# EAGLE design MainBoard (EAGLE 9.6.2)
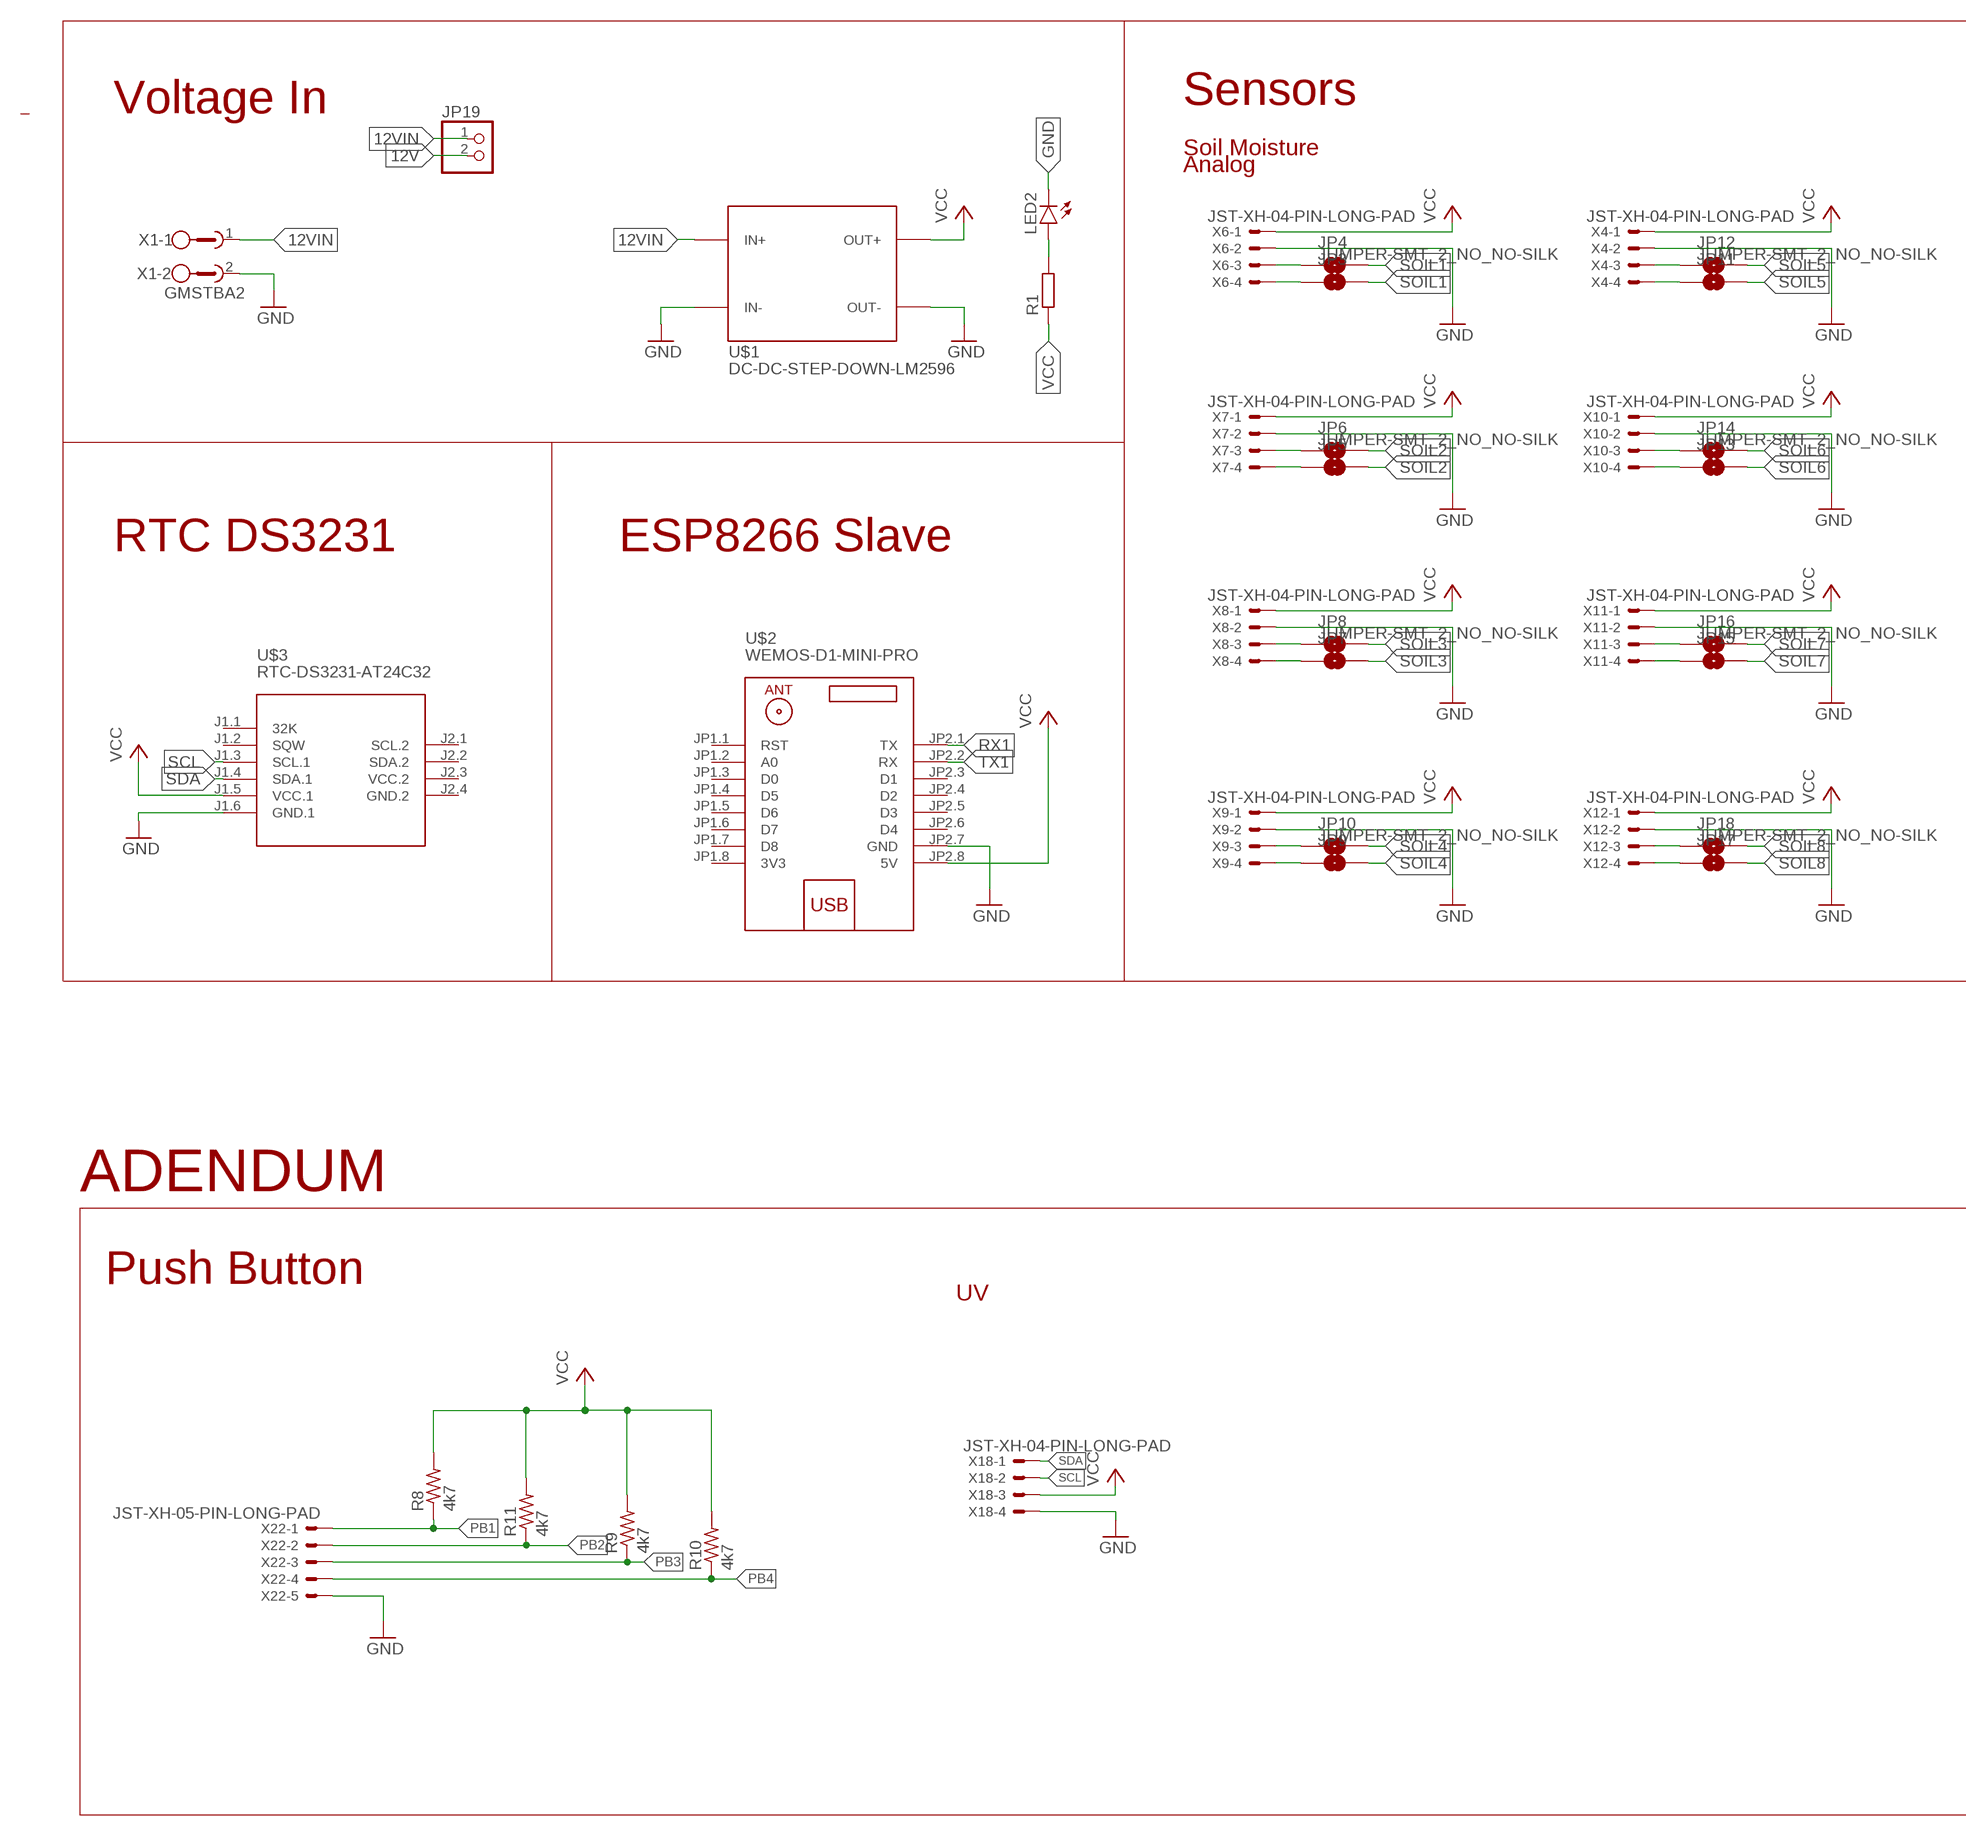
[diagram p0: schematic, sheet 1, part 1 of 2]
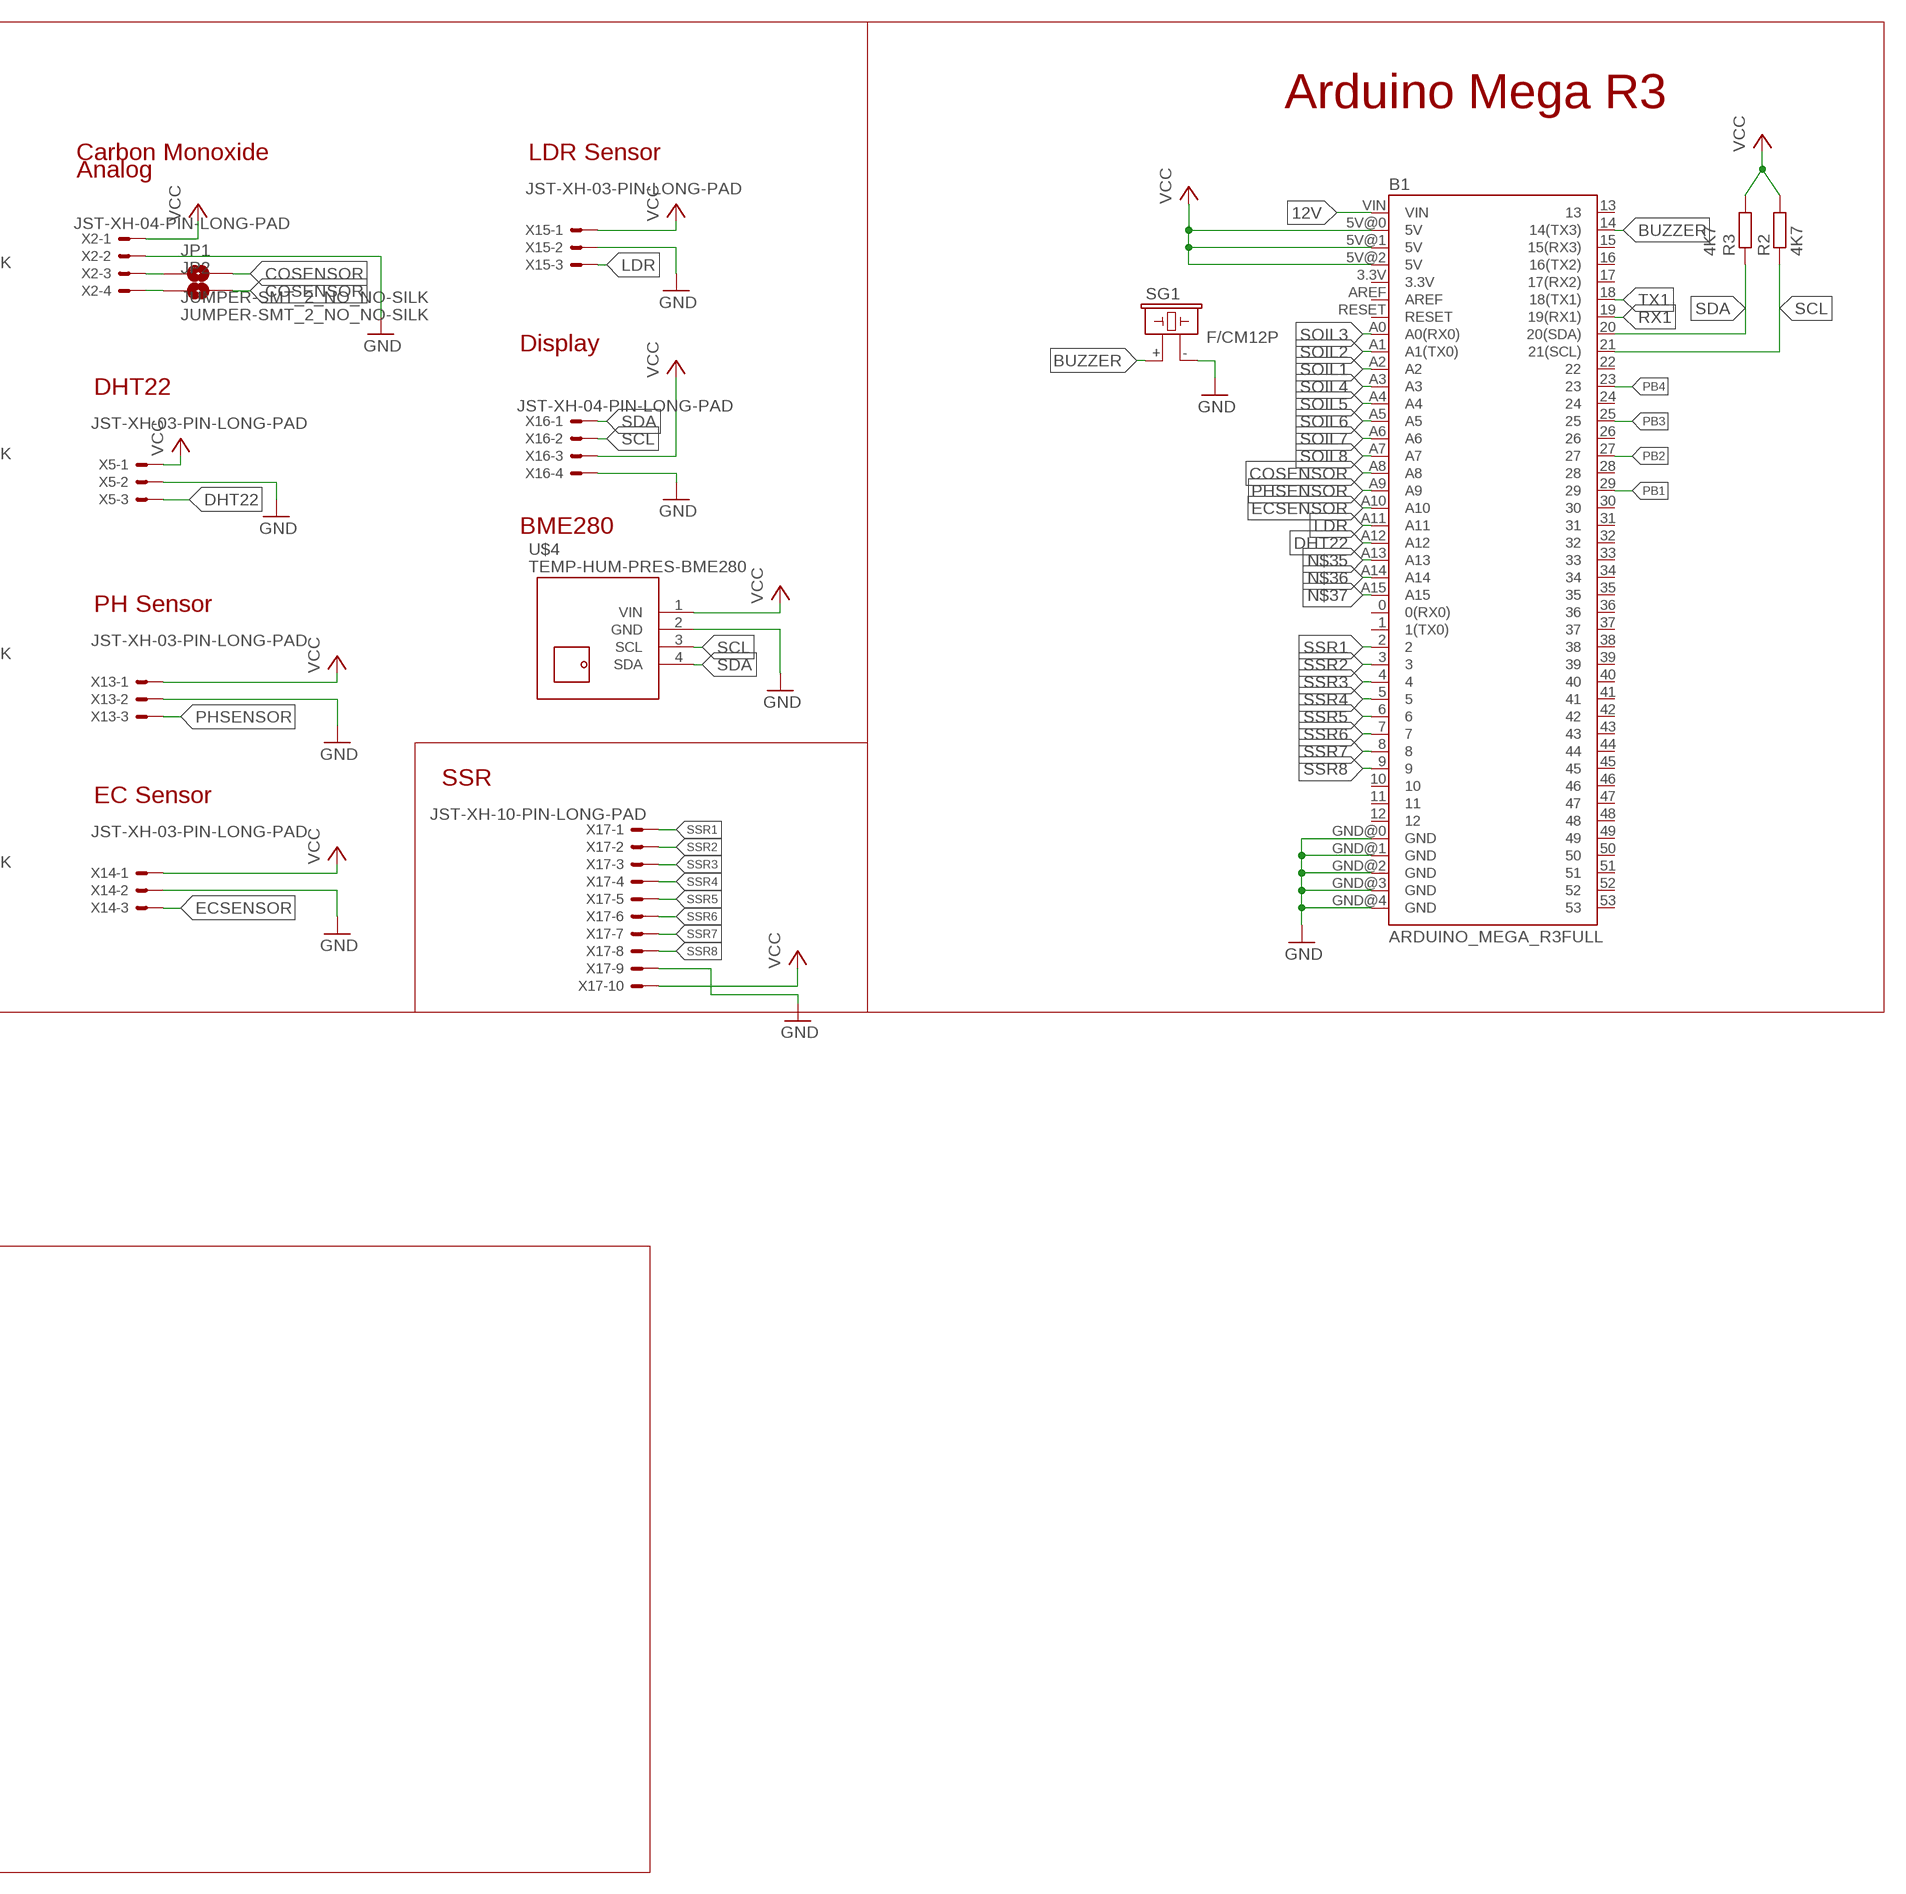
[diagram p1: schematic, sheet 1, part 2 of 2]

## Parts
B1  ARDUINO_MEGA_R3FULL  [ARDUINO_MEGA]
JP1  JUMPER-SMT_2_NO_NO-SILK  [SMT-JUMPER_2_NO_NO-SILK]
JP2  JUMPER-SMT_2_NO_NO-SILK  [SMT-JUMPER_2_NO_NO-SILK]
JP3  JUMPER-SMT_2_NO_NO-SILK  [SMT-JUMPER_2_NO_NO-SILK]
JP4  JUMPER-SMT_2_NO_NO-SILK  [SMT-JUMPER_2_NO_NO-SILK]
JP5  JUMPER-SMT_2_NO_NO-SILK  [SMT-JUMPER_2_NO_NO-SILK]
JP6  JUMPER-SMT_2_NO_NO-SILK  [SMT-JUMPER_2_NO_NO-SILK]
JP7  JUMPER-SMT_2_NO_NO-SILK  [SMT-JUMPER_2_NO_NO-SILK]
JP8  JUMPER-SMT_2_NO_NO-SILK  [SMT-JUMPER_2_NO_NO-SILK]
JP9  JUMPER-SMT_2_NO_NO-SILK  [SMT-JUMPER_2_NO_NO-SILK]
JP10  JUMPER-SMT_2_NO_NO-SILK  [SMT-JUMPER_2_NO_NO-SILK]
JP11  JUMPER-SMT_2_NO_NO-SILK  [SMT-JUMPER_2_NO_NO-SILK]
JP12  JUMPER-SMT_2_NO_NO-SILK  [SMT-JUMPER_2_NO_NO-SILK]
JP13  JUMPER-SMT_2_NO_NO-SILK  [SMT-JUMPER_2_NO_NO-SILK]
JP14  JUMPER-SMT_2_NO_NO-SILK  [SMT-JUMPER_2_NO_NO-SILK]
JP15  JUMPER-SMT_2_NO_NO-SILK  [SMT-JUMPER_2_NO_NO-SILK]
JP16  JUMPER-SMT_2_NO_NO-SILK  [SMT-JUMPER_2_NO_NO-SILK]
JP17  JUMPER-SMT_2_NO_NO-SILK  [SMT-JUMPER_2_NO_NO-SILK]
JP18  JUMPER-SMT_2_NO_NO-SILK  [SMT-JUMPER_2_NO_NO-SILK]
JP19  PINHD-1X2  [1X02]
LED2  LED5MM  [LED5MM]
R1  R-EU_R0805  [R0805]
R2  4K7  R-EU_M0805  [M0805]
R3  4K7  R-EU_M0805  [M0805]
R8  4k7  R-US_M0805  [M0805]
R9  4k7  R-US_M0805  [M0805]
R10  4k7  R-US_M0805  [M0805]
R11  4k7  R-US_M0805  [M0805]
SG1  F/CM12P  [F/CM12P]
U$1  DC-DC-STEP-DOWN-LM2596  [DC-DC-STEP-DOWN-LM2596]
U$2  WEMOS-D1-MINI-PRO  [WEMOS-D1-MINI-PRO]
U$3  RTC-DS3231-AT24C32  [RTC-DS3231-AT24C32]
U$4  TEMP-HUM-PRES-BME280  [TEMP-HUM-PRES-BME280]
X1  GMSTBA2  [GMSTBA2]
X2  JST-XH-04-PIN-LONG-PAD  [JST-XH-04-PACKAGE-LONG-PAD]
X4  JST-XH-04-PIN-LONG-PAD  [JST-XH-04-PACKAGE-LONG-PAD]
X5  JST-XH-03-PIN-LONG-PAD  [JST-XH-03-PACKAGE-LONG-PAD]
X6  JST-XH-04-PIN-LONG-PAD  [JST-XH-04-PACKAGE-LONG-PAD]
X7  JST-XH-04-PIN-LONG-PAD  [JST-XH-04-PACKAGE-LONG-PAD]
X8  JST-XH-04-PIN-LONG-PAD  [JST-XH-04-PACKAGE-LONG-PAD]
X9  JST-XH-04-PIN-LONG-PAD  [JST-XH-04-PACKAGE-LONG-PAD]
X10  JST-XH-04-PIN-LONG-PAD  [JST-XH-04-PACKAGE-LONG-PAD]
X11  JST-XH-04-PIN-LONG-PAD  [JST-XH-04-PACKAGE-LONG-PAD]
X12  JST-XH-04-PIN-LONG-PAD  [JST-XH-04-PACKAGE-LONG-PAD]
X13  JST-XH-03-PIN-LONG-PAD  [JST-XH-03-PACKAGE-LONG-PAD]
X14  JST-XH-03-PIN-LONG-PAD  [JST-XH-03-PACKAGE-LONG-PAD]
X15  JST-XH-03-PIN-LONG-PAD  [JST-XH-03-PACKAGE-LONG-PAD]
X16  JST-XH-04-PIN-LONG-PAD  [JST-XH-04-PACKAGE-LONG-PAD]
X17  JST-XH-10-PIN-LONG-PAD  [JST-XH-10-PACKAGE-LONG-PAD]
X18  JST-XH-04-PIN-LONG-PAD  [JST-XH-04-PACKAGE-LONG-PAD]
X22  JST-XH-05-PIN-LONG-PAD  [JST-XH-05-PACKAGE-LONG-PAD]

## Nets
12V: B1.VIN JP19.2
12VIN: JP19.1 U$1.IN+ X1.1
BUZZER: B1.14(14(TX3)) SG1.+
COSENSOR: B1.A8 JP1.2 JP2.2
DHT22: B1.A12 X5.3
ECSENSOR: B1.A10 X14.3
GND: B1.GND@0(GND) B1.GND@1(GND) B1.GND@2(GND) B1.GND@3(GND) B1.GND@4(GND) LED2.K(C) SG1.- U$1.IN- U$1.OUT- U$2.JP2.7(GND) U$3.J1.6(GND.1) U$4.2(GND) X1.2 X2.2 X4.2 X5.2 X6.2 X7.2 X8.2 X9.2 X10.2 X11.2 X12.2 X13.2 X14.2 X15.2 X16.4 X17.9 X18.4 X22.5
LDR: B1.A11 X15.3
N$1: JP1.1 X2.3
N$2: JP2.1 X2.4
N$5: JP3.1 X6.4
N$6: JP4.1 X6.3
N$7: LED2.A R1.2
N$8: JP5.1 X7.4
N$9: JP6.1 X7.3
N$10: JP7.1 X8.4
N$11: JP8.1 X8.3
N$12: JP9.1 X9.4
N$13: JP10.1 X9.3
N$14: JP11.1 X4.4
N$15: JP12.1 X4.3
N$16: JP13.1 X10.4
N$17: JP14.1 X10.3
N$18: JP15.1 X11.4
N$19: JP16.1 X11.3
N$20: JP17.1 X12.4
N$21: JP18.1 X12.3
N$35: B1.A13
N$36: B1.A14
N$37: B1.A15
PB1: B1.29 R8.1 X22.1
PB2: B1.27 R11.1 X22.2
PB3: B1.25 R9.1 X22.3
PB4: B1.23 R10.1 X22.4
PHSENSOR: B1.A9 X13.3
RX1: B1.19(19(RX1)) U$2.JP2.1(TX)
SCL: B1.21(21(SCL)) R2.1 U$3.J1.3(SCL.1) U$4.3(SCL) X16.2 X18.2
SDA: B1.20(20(SDA)) R3.1 U$3.J1.4(SDA.1) U$4.4(SDA) X16.1 X18.1
SOIL1: B1.A2 JP3.2 JP4.2
SOIL2: B1.A1(A1(TX0)) JP5.2 JP6.2
SOIL3: B1.A0(A0(RX0)) JP7.2 JP8.2
SOIL4: B1.A3 JP9.2 JP10.2
SOIL5: B1.A4 JP11.2 JP12.2
SOIL6: B1.A5 JP13.2 JP14.2
SOIL7: B1.A6 JP15.2 JP16.2
SOIL8: B1.A7 JP17.2 JP18.2
SSR1: B1.2 X17.1
SSR2: B1.3 X17.2
SSR3: B1.4 X17.3
SSR4: B1.5 X17.4
SSR5: B1.6 X17.5
SSR6: B1.7 X17.6
SSR7: B1.8 X17.7
SSR8: B1.9 X17.8
TX1: B1.18(18(TX1)) U$2.JP2.2(RX)
VCC: B1.5V@0(5V) B1.5V@1(5V) B1.5V@2(5V) R1.1 R2.2 R3.2 R8.2 R9.2 R10.2 R11.2 U$1.OUT+ U$2.JP2.8(5V) U$3.J1.5(VCC.1) U$4.1(VIN) X2.1 X4.1 X5.1 X6.1 X7.1 X8.1 X9.1 X10.1 X11.1 X12.1 X13.1 X14.1 X15.1 X16.3 X17.10 X18.3
Unconnected: B1.0(0(RX0)) B1.1(1(TX0)) B1.3.3V B1.10 B1.11 B1.12 B1.13 B1.15(15(RX3)) B1.16(16(TX2)) B1.17(17(RX2)) B1.22 B1.24 B1.26 B1.28 B1.30 B1.31 B1.32 B1.33 B1.34 B1.35 B1.36 B1.37 B1.38 B1.39 B1.40 B1.41 B1.42 B1.43 B1.44 B1.45 B1.46 B1.47 B1.48 B1.49 B1.50 B1.51 B1.52 B1.53 B1.AREF B1.RESET U$2.JP1.1(RST) U$2.JP1.2(A0) U$2.JP1.3(D0) U$2.JP1.4(D5) U$2.JP1.5(D6) U$2.JP1.6(D7) U$2.JP1.7(D8) U$2.JP2.3(D1) U$2.JP2.4(D2) U$2.JP2.5(D3) U$2.JP2.6(D4) U$3.J1.1(32K) U$3.J1.2(SQW) U$3.J2.1(SCL.2) U$3.J2.2(SDA.2)

## Notes on the sheet
- Voltage In | Sensors | Arduino Mega R3
- Soil Moisture | Carbon Monoxide | LDR Sensor
- Analog | Analog
- Display
- DHT22
- BME280
- RTC DS3231 | ESP8266 Slave
- PH Sensor
- SSR
- EC Sensor
- ADENDUM
- Push Button
- UV

## Power pins joined to a net without a drawn wire
3V3: U$2.JP1.8(3V3)
GND.2: U$3.J2.4(GND.2)
VCC.2: U$3.J2.3(VCC.2)

## Library data of the parts
B1 = SparkFun-Boards:ARDUINO_MEGA_R3: Arduino Mega R3 ATmega2560 R3 compatible footprint. SparkFun Products: Arduino Mega 2560 R3 <https://www.sparkfun.com/products/11061>
JP1-JP18 = SparkFun-Jumpers:JUMPER-SMT_2_NO: Normally open jumper This jumper has two pads in close proximity to each other. Apply solder to close the connection. Round pads are easier to solder for beginners, but are a lot larger. SparkFun Product that uses the round pads: SparkFun EL Sequencer <https://www.sparkfun.com/products/12781>
JP19 = pinhead:PINHD-1X2: PIN HEADER
LED2 = led:LED: LED OSRAM: - CHIPLED LG R971, LG N971, LY N971, LG Q971, LY Q971, LO R971, LY R971 LH N974, LH R974 LS Q976, LO Q976, LY Q976 LO Q996 - Hyper CHIPLED LW Q18S LB Q993, LB Q99A, LB R99A - SideLED LS A670, LO A670, LY A670, LG A670, LP A670 LB A673, LV A673, LT A673, LW A673 LH A674 LY A675 LS A676, LA A676, LO A676, LY A676, LW A676 LS A679, LY A679, LG A679 - Hyper Micro SIDELED® LS Y876, LA Y876, LO Y876, LY Y876 LT Y87S - SmartLED LW L88C, LW L88S LB L89C, LB L89S, LG L890 LS L89K, LO L89K, LY L89K LS L896, LA L896, LO L896, LY L896 - TOPLED LS T670, LO T670, LY T670, LG T670, LP T670 LSG T670, LSP T670, LSY T670, LOP T670, LYG T670 LG T671, LOG T671, LSG T671 LB T673, LV T673, LT T673, LW T673 LH T674 LS T676, LA T676, LO T676, LY T676, LB T676, LH T676, LSB T676, LW T676 LB T67C, LV T67C, LT T67C, LS T67K, LO T67K, LY T67K, LW E67C LS E67B, LA E67B, LO E67B, LY E67B, LB E67C, LV E67C, LT E67C LW T67C LS T679, LY T679, LG T679 LS T770, LO T770, LY T770, LG T770, LP T770 LB T773, LV T773, LT T773, LW T773 LH T774 LS E675, LA E675, LY E675, LS T675 LS T776, LA T776, LO T776, LY T776, LB T776 LHGB T686 LT T68C, LB T68C - Hyper Mini TOPLED® LB M676 - Mini TOPLED Santana® LG M470 LS M47K, LO M47K, LY M47K Source: http://www.osram.convergy.de LUXEON: - LUMILED® LXK2-PW12-R00, LXK2-PW12-S00, LXK2-PW14-U00, LXK2-PW14-V00 LXK2-PM12-R00, LXK2-PM12-S00, LXK2-PM14-U00 LXK2-PE12-Q00, LXK2-PE12-R00, LXK2-PE12-S00, LXK2-PE14-T00, LXK2-PE14-U00 LXK2-PB12-K00, LXK2-PB12-L00, LXK2-PB12-M00, LXK2-PB14-N00, LXK2-PB14-P00, LXK2-PB14-Q00 LXK2-PR12-L00, LXK2-PR12-M00, LXK2-PR14-Q00, LXK2-PR14-R00 LXK2-PD12-Q00, LXK2-PD12-R00, LXK2-PD12-S00 LXK2-PH12-R00, LXK2-PH12-S00 LXK2-PL12-P00, LXK2-PL12-Q00, LXK2-PL12-R00 Source: www.luxeon.com KINGBRIGHT: KA-3528ASYC Source: www.kingbright.com
R1-R3 = rcl:R-EU_: RESISTOR, European symbol; SPICEPREFIX: R
R8-R11 = rcl:R-US_: RESISTOR, American symbol; SPICEPREFIX: R
SG1 = buzzer:F/CM12P: BUZZER Source: Buerklin; OC_FARNELL: unknown; OC_NEWARK: unknown
U$1 = diy-modules:DC-DC-STEP-DOWN-LM2596: DC/DC Step-Down Regulator based on LM2596-ADJ chip LM2596 datasheet available here: http://www.ti.com/lit/ds/symlink/lm2596.pdf Click here to find device on ebay.com <http://www.ebay.com/sch/lm2596+power+regulator>
U$2 = diy-modules:WEMOS-D1-MINI-PRO: WEMOS D1 mini Pro: Mini Wi-Fi Board based on ESP-8266EX chip More details can be found here: https://www.wemos.cc/product/d1-mini-pro.html Click here to find device on ebay.com <http://www.ebay.com/sch/wemos+d1+mini+pro>
U$3 = diy-modules:RTC-DS3231-AT24C32: RTC Module with Battery and EEPROM based on DS3231 and AT24C32 chips Tutorial can be found here: https://edwardmallon.wordpress.com/2014/05/21/using-a-cheap-3-ds3231-rtc-at24c32-eeprom-from-ebay/ Click here to find device on ebay.com <http://www.ebay.com/sch/DS3231+AT24C32+module>
U$4 = diy-modules:TEMP-HUM-PRES-BME280: Digital Humidity-Temperature-Pressure Sensor based on BME280 device More information about BME280 device is available here: https://www.bosch-sensortec.com/bst/products/all_products/bme280 Click here to find device on ebay.com <http://www.ebay.com/sch/bme280+breakout>
X1 = con-phoenix-762:GMSTBA2: PHOENIX; MF: FARNELL; MPN: 1757242; OC_FARNELL: 3705171; OC_NEWARK: 71C4161
X2 X4 X6-X12 X16 X18 = Rembrandt Electronics - JST XH Connectors v1-0:JST-XH-04-PIN: JST XH Connector 2 Pin Wire to board connector. Pitch: 2,54 mm, (0.100") Number of pins: 4 Created by Rembrandt Electronics www.rembrandtelectronics.com
X5 X13-X15 = Rembrandt Electronics - JST XH Connectors v1-0:JST-XH-03-PIN: JST XH Connector 2 Pin Wire to board connector. Pitch: 2,54 mm, (0.100") Number of pins: 3 Created by Rembrandt Electronics www.rembrandtelectronics.com
X17 = Rembrandt Electronics - JST XH Connectors v1-0:JST-XH-10-PIN: JST XH Connector 2 Pin Wire to board connector. Pitch: 2,54 mm, (0.100") Number of pins: 10 Created by Rembrandt Electronics www.rembrandtelectronics.com
X22 = Rembrandt Electronics - JST XH Connectors v1-0:JST-XH-05-PIN: JST XH Connector 2 Pin Wire to board connector. Pitch: 2,54 mm, (0.100") Number of pins: 5 Created by Rembrandt Electronics www.rembrandtelectronics.com

## Board
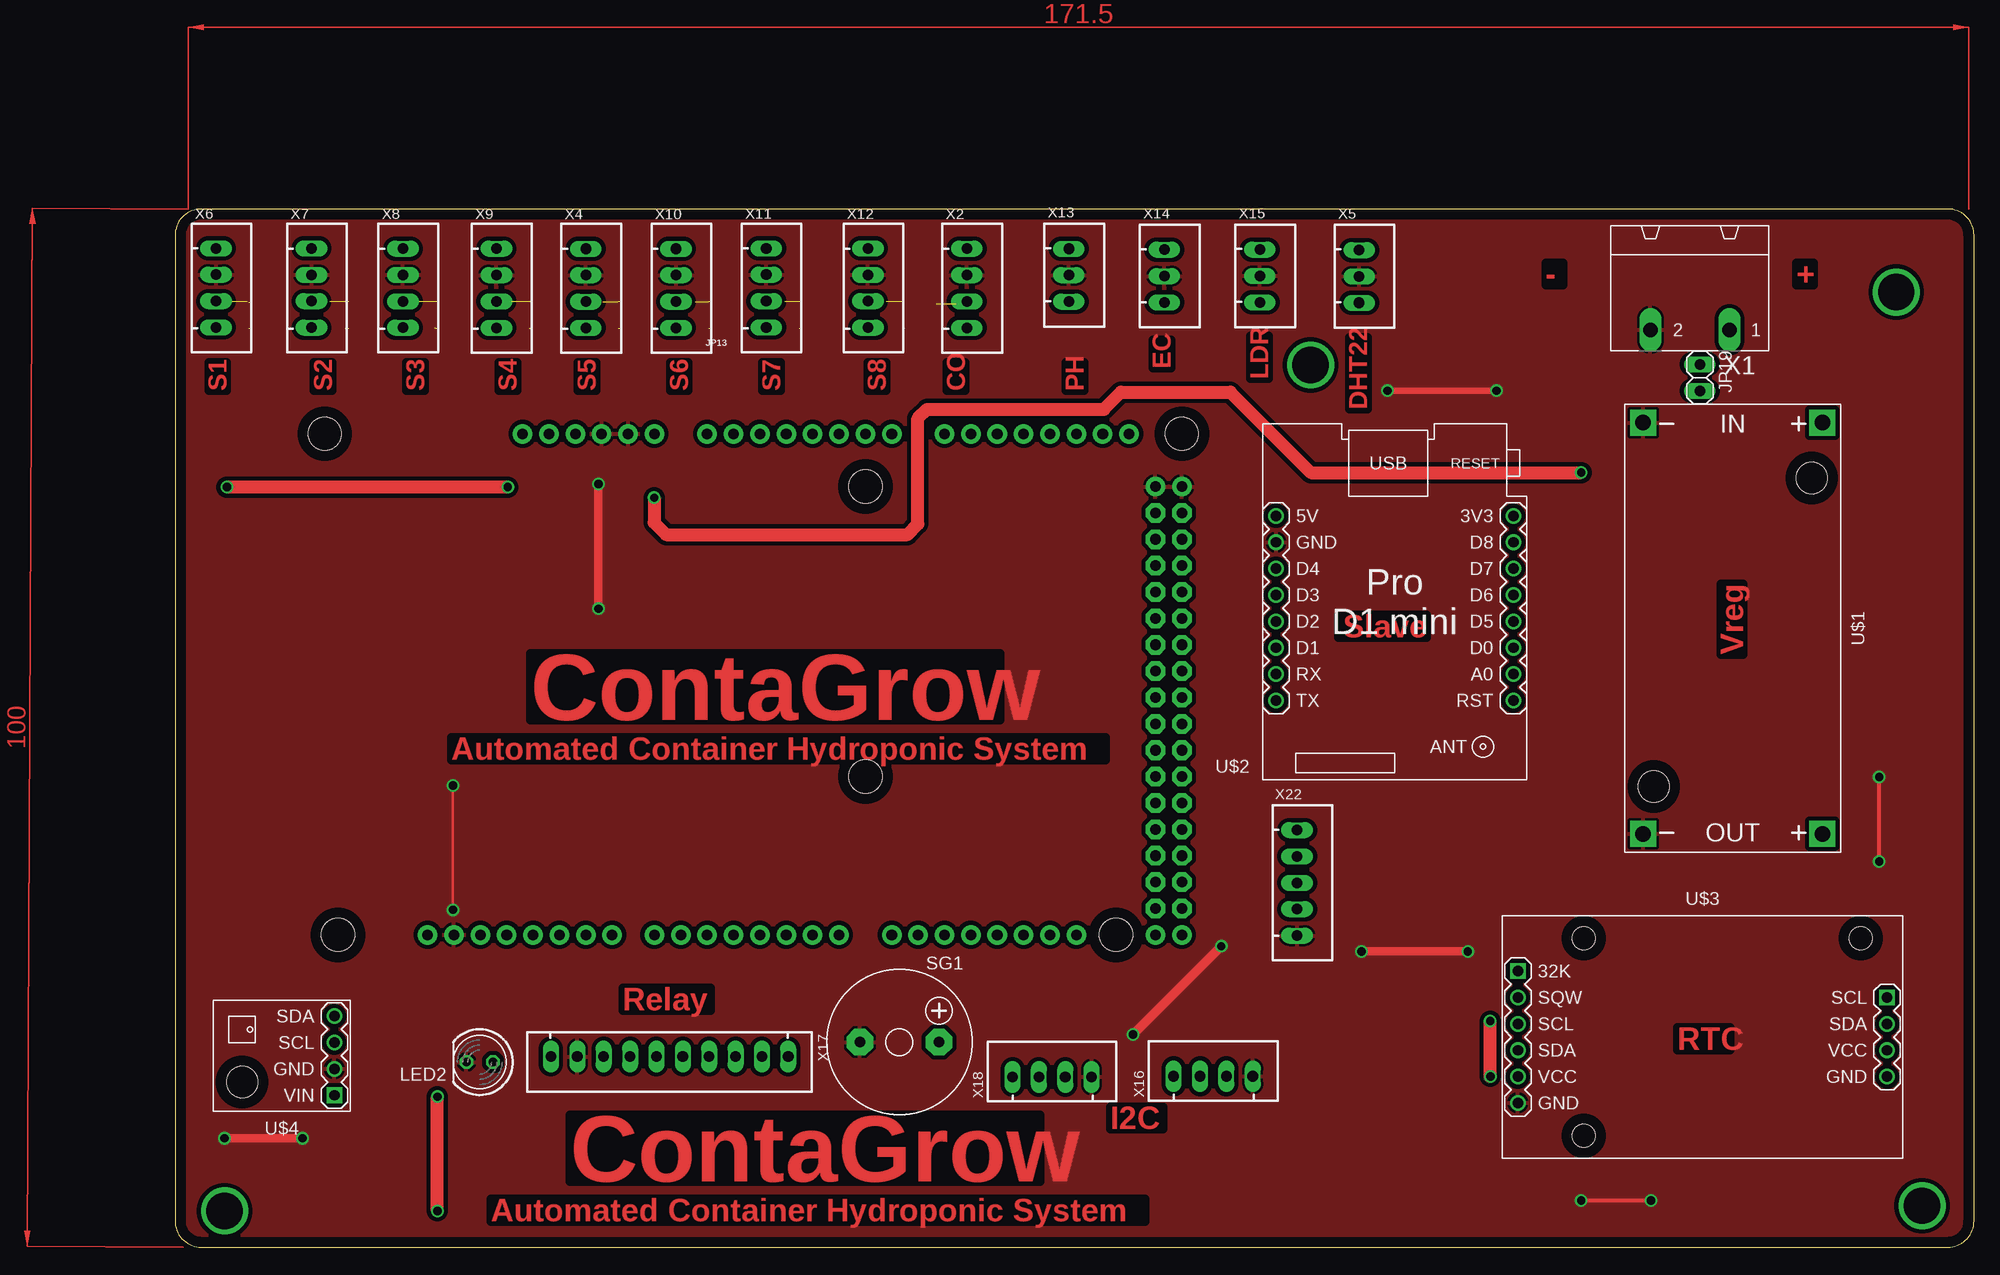
[diagram p2: board, top side]
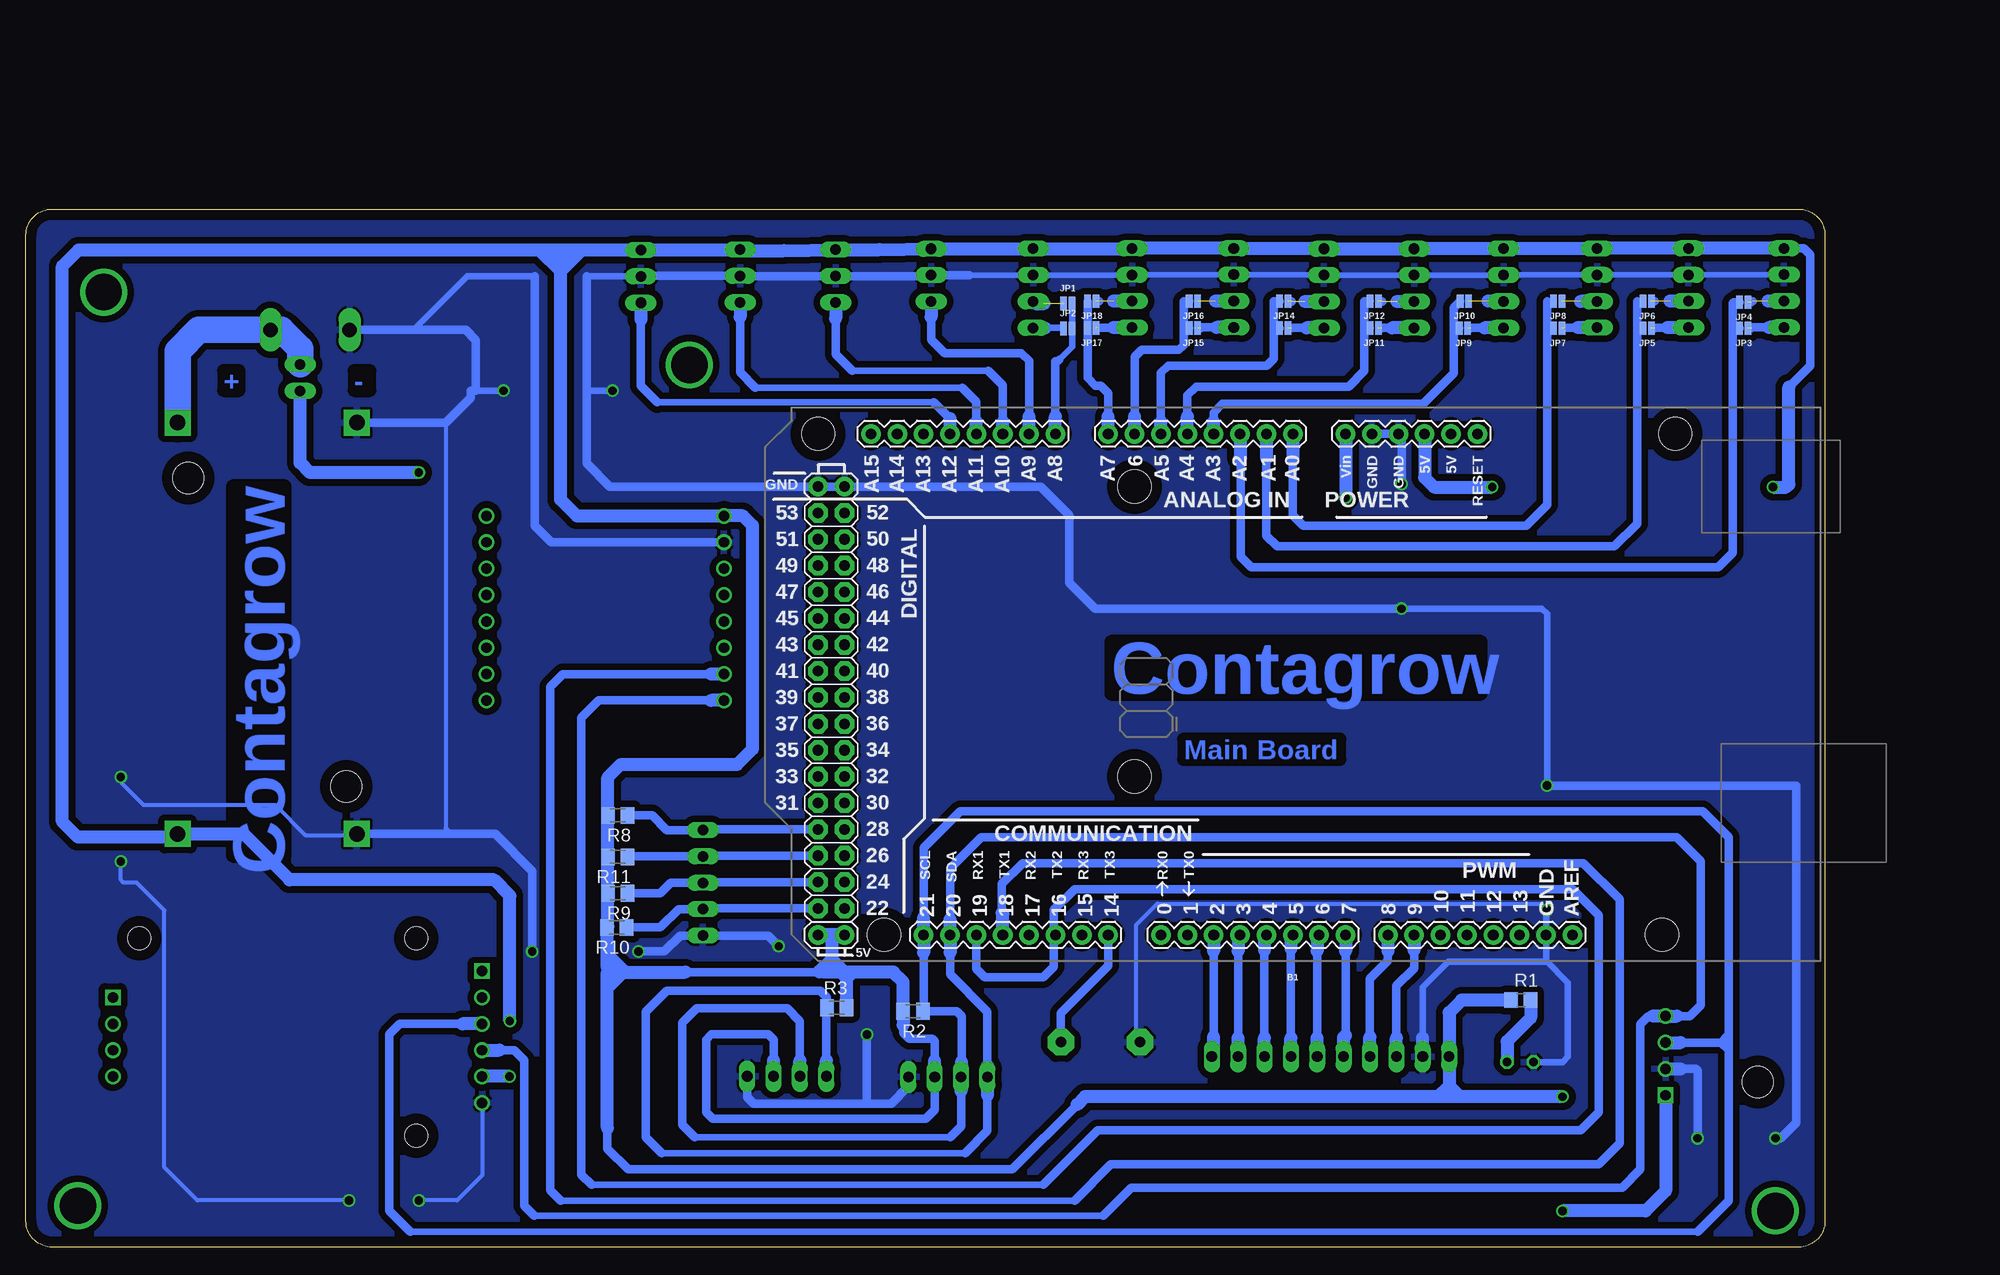
[diagram p3: board, bottom side, seen from below]

Size 173.27 x 100 mm. Coordinates in mm from the lower left corner, seen from the top.
Outline: 2.54,0 170.73,0 arc90 173.27,2.54 173.27,97.46 arc90 170.73,100 2.54,100 arc90 0,97.46 0,2.54 arc90 2.54,0
Copper layers (1*16): Top 0.035mm / dielectric 1.5mm / Bottom 0.035mm
Design rules "default *": minimum track width 6mil, minimum drill 0.35mm, track to track 16mil, track to pad 16mil, pad to pad 16mil, via to via 16mil, smd to smd 16mil, copper to edge 40mil, drill to drill 6mil, minimum pad ring 10mil, minimum via ring 8mil, stop-mask expansion 4mil, vias tented up to drill 0mil, thermal gap 10mil

### Footprints (pad centres in the part's own frame; a part is rotated, then mirrored left to right if it is on the bottom)
ARDUINO_MEGA = drill 1.016 pad 1.88: 0 13.97,24.13; 1 11.43,24.13; 2 8.89,24.13; 3 6.35,24.13; 3.3V -13.97,-24.13; 4 3.81,24.13; 5 1.27,24.13; 5V@0 -11.43,-24.13; 5V@1 44.45,24.13; 5V@2 46.99,24.13; 6 -1.27,24.13; 7 -3.81,24.13; 8 -7.874,24.13; 9 -10.414,24.13; 10 -12.954,24.13; 11 -15.494,24.13; 12 -18.034,24.13; 13 -20.574,24.13; 14 19.05,24.13; 15 21.59,24.13; 16 24.13,24.13; 17 26.67,24.13; 18 29.21,24.13; 19 31.75,24.13; 20 34.29,24.13; 21 36.83,24.13; A0 1.27,-24.13; A1 3.81,-24.13; A2 6.35,-24.13; A3 8.89,-24.13; A4 11.43,-24.13; A5 13.97,-24.13; A6 16.51,-24.13; A7 19.05,-24.13; A8 24.13,-24.13; A9 26.67,-24.13; A10 29.21,-24.13; A11 31.75,-24.13; A12 34.29,-24.13; A13 36.83,-24.13; A14 39.37,-24.13; A15 41.91,-24.13; AREF -25.654,24.13; GND@0 -8.89,-24.13; GND@1 -6.35,-24.13; GND@2 44.45,-19.05; GND@3 46.99,-19.05; GND@4 -23.114,24.13; RESET -16.51,-24.13; VIN -3.81,-24.13 | drill 1.016 pad 1.88 octagon: 22 44.45,21.59; 23 46.99,21.59; 24 44.45,19.05; 25 46.99,19.05; 26 44.45,16.51; 27 46.99,16.51; 28 44.45,13.97; 29 46.99,13.97; 30 44.45,11.43; 31 46.99,11.43; 32 44.45,8.89; 33 46.99,8.89; 34 44.45,6.35; 35 46.99,6.35; 36 44.45,3.81; 37 46.99,3.81; 38 44.45,1.27; 39 46.99,1.27; 40 44.45,-1.27; 41 46.99,-1.27; 42 44.45,-3.81; 43 46.99,-3.81; 44 44.45,-6.35; 45 46.99,-6.35; 46 44.45,-8.89; 47 46.99,-8.89; 48 44.45,-11.43; 49 46.99,-11.43; 50 44.45,-13.97; 51 46.99,-13.97; 52 44.45,-16.51; 53 46.99,-16.51 | hole 3.2: -34.29,24.13; -35.56,-24.13; 16.51,8.89; 16.51,-19.05; 40.64,24.13; 46.99,-24.13
SMT-JUMPER_2_NO_NO-SILK = smd 0.635 x 1.27: 1 -0.406,0; 2 0.406,0
1X02 = drill 1.016 long: 1 -1.27,0; 2 1.27,0
LED5MM = drill 0.813 octagon: A -1.27,0; K 1.27,0
R0805 = smd 1.3 x 1.5: 1 -0.95,0; 2 0.95,0
M0805 = smd 1.3 x 1.6: 1 -0.95,0; 2 0.95,0
F/CM12P = drill 1.016 pad 2.54 octagon: + 3.81,0; - -3.81,0
DC-DC-STEP-DOWN-LM2596 = drill 1.5 pad 2.5 square: IN+ -19.812,8.636; IN- -19.812,-8.636; OUT+ 19.812,8.636; OUT- 19.812,-8.636 | hole 3: -14.478,7.62; 15.24,-7.62
WEMOS-D1-MINI-PRO = drill 1: JP1.1 -11.43,9.525; JP1.2 -11.43,6.985; JP1.3 -11.43,4.445; JP1.4 -11.43,1.905; JP1.5 -11.43,-0.635; JP1.6 -11.43,-3.175; JP1.7 -11.43,-5.715; JP1.8 -11.43,-8.255; JP2.1 11.43,9.525; JP2.2 11.43,6.985; JP2.3 11.43,4.445; JP2.4 11.43,1.905; JP2.5 11.43,-0.635; JP2.6 11.43,-3.175; JP2.7 11.43,-5.715; JP2.8 11.43,-8.255
RTC-DS3231-AT24C32 = drill 1 square: J1.1 -17.78,6.35; J2.1 17.78,3.81 | drill 1: J1.2 -17.78,3.81; J1.3 -17.78,1.27; J1.4 -17.78,-1.27; J1.5 -17.78,-3.81; J1.6 -17.78,-6.35; J2.2 17.78,1.27; J2.3 17.78,-1.27; J2.4 17.78,-3.81 | hole 2.2: -11.43,-9.525; -11.43,9.525; 15.24,9.525
TEMP-HUM-PRES-BME280 = drill 1 square: 1 -5.08,3.81 | drill 1: 2 -5.08,1.27; 3 -5.08,-1.27; 4 -5.08,-3.81 | hole 3: 3.81,2.54
GMSTBA2 = drill 1.397 long: 1 -3.81,5.08; 2 3.81,5.08
JST-XH-04-PACKAGE-LONG-PAD = drill 1.016 long: 1 -3.81,0; 2 -1.27,0; 3 1.27,0; 4 3.81,0
JST-XH-03-PACKAGE-LONG-PAD = drill 1.016 long: 1 -2.54,0; 2 0,0; 3 2.54,0
JST-XH-10-PACKAGE-LONG-PAD = drill 1.016 long: 1 -11.43,0; 2 -8.89,0; 3 -6.35,0; 4 -3.81,0; 5 -1.27,0; 6 1.27,0; 7 3.81,0; 8 6.35,0; 9 8.89,0; 10 11.43,0
JST-XH-05-PACKAGE-LONG-PAD = drill 1.016 long: 1 -5.08,0; 2 -2.54,0; 3 0,0; 4 2.54,0; 5 5.08,0

### Placement (x,y rotation side)
B1  49.98,54.22 180 bottom
JP1  72.92,90.89 0 bottom
JP2  72.92,88.49 0 bottom
JP3  7.82,88.51 180 bottom
JP4  7.82,91.01 180 bottom
JP5  17.12,88.51 180 bottom
JP6  17.12,91.11 180 bottom
JP7  25.72,88.51 180 bottom
JP8  25.72,91.11 180 bottom
JP9  34.82,88.51 180 bottom
JP10  34.72,91.13 180 bottom
JP11  43.42,88.53 180 bottom
JP12  43.42,91.13 180 bottom
JP13  52.12,88.53 180 bottom
JP14  52.12,91.13 180 bottom
JP15  60.82,88.53 180 bottom
JP16  60.82,91.13 180 bottom
JP17  70.62,88.53 180 bottom
JP18  70.62,91.13 180 bottom
JP19  146.86,83.76 270 top
LED2  29.34,17.83 180 top
R1  29.29,23.8 0 bottom
R2  87.83,22.73 180 bottom
R3  95.17,23.07 0 bottom
R8  116.27,41.6 180 bottom
R9  116.27,34.1 180 bottom
R10  116.37,30.8 180 bottom
R11  116.27,37.6 180 bottom
SG1  69.77,19.75 0 top
U$1  150.03,59.62 270 top
U$2  117.47,62.19 180 top
U$3  147.12,20.25 0 top
U$4  10.27,18.45 180 top
X1  145.9,93.44 180 top
X2  76.26,92.37 270 top
X4  39.56,92.36 270 top
X5  114.05,93.51 270 top
X6  3.95,92.4 270 top
X7  13.15,92.39 270 top
X8  21.95,92.38 270 top
X9  30.95,92.37 270 top
X10  48.25,92.36 270 top
X11  56.94,92.4 270 top
X12  66.74,92.39 270 top
X13  86.08,93.63 270 top
X14  95.28,93.54 270 top
X15  104.48,93.55 270 top
X16  99.99,16.47 0 top
X17  47.63,18.37 180 top
X18  84.47,16.4 0 top
X22  108.07,35.1 270 top

### Tracks (layer width: path | path; a pad name or v marks a point on that pad's centre or on a via)
12V  (via drill 0.79)
  Top 1.27: v46.15,72.2 46.15,69.79 47.29,68.65 70.53,68.65 71.55,69.66 71.55,79.82 72.44,80.71 89.45,80.71 91.11,82.36 101.65,82.36 109.39,74.62 v135.43,74.62
  Bottom 1.27: B1.VIN 46.17,72.22 v46.15,72.2 | v135.43,74.62 145.93,74.62 146.86,75.55 JP19.2
12VIN
  Bottom 2.54: U$1.IN+ 158.67,85.03 | 158.67,85.03 | 158.67,85.03 158.67,86.3 156.61,88.36 X1.1 148.67,88.36 146.86,86.55 JP19.1
BUZZER
  Bottom 0.813: B1.14 69.03,27.1 73.58,22.55 SG1.+
COSENSOR
  Bottom 0.61: JP1.2 JP2.2 72.51,86.76 73.77,85.5
  Bottom 0.813: 74.11,80 74.11,83.5 74.11,85 74.11,85.16 | 74.11,85.16 74.11,85.34 | 73.77,85.5 74.11,85.16
  Bottom 1.27: B1.A8 74.11,80
DHT22
  Bottom 0.61: 112.46,81.38 85.85,81.38
  Bottom 0.813: 114.05,89.35 114.05,82.97 112.46,81.38 | 84.27,79.8 85.85,81.38
  Bottom 1.27: B1.A12 84.27,79.8 | X5.3 114.05,89.35
ECSENSOR
  Bottom 0.61: 93.68,84.4 80.57,84.4
  Bottom 0.813: 95.28,89.47 95.28,86 93.68,84.4 | 80.57,84.4 79.19,83.02 79.19,79.5
  Bottom 1.27: B1.A10 79.19,79.5 | X14.3 95.28,89.47
GND  (via drill 0.8)
  Top 0.254: v26.77,44.46 v26.77,32.5
  Top 0.406: v135.43,4.51 v142.16,4.51 | v164.13,37.15 v164.13,45.28
  Top 0.61: v127.27,82.5 v116.77,82.5
  Top 0.813: v92.27,20.5 v100.77,29 | v114.27,28.5 v124.51,28.5 | v12.27,10.5 v4.77,10.5 | v40.77,61.5 v40.77,73.5
  Bottom 0.406: U$3.J1.6 129.34,6.92 131.75,4.51 v135.43,4.51 | 132.84,79.43 132.84,40.39 132.25,39.81 | v142.16,4.51 156.77,4.51 159.94,7.69 159.94,32.45 162.61,35.12 163.88,35.12 164.13,35.37 v164.13,37.15 | v164.13,45.28 164.13,44.77 161.97,42.61 149.27,42.61 146.35,39.69 141.51,39.69 U$1.OUT- | SG1.- 66.34,20.13 66.34,31.05 64.31,33.09 27.36,33.09 v26.77,32.5
  Bottom 0.508: 82.4,93.63 76.31,93.63 76.28,93.66 | X2.2 66.13,93.64 66.07,93.7 66.72,93.7 X12.2 | X12.2 X11.2 48.29,93.67 X10.2 X4.2 X9.2 X8.2 | X6.2 X7.2 X8.2
  Bottom 0.61: X5.2 119.26,93.51 | 124.27,93.5 130.77,93.5 135.91,88.36 X1.2 | v26.77,32.5 26.87,32.4 B1.GND@4 26.87,27.6 | v26.77,44.46 26.77,61 27.27,61.5 v40.77,61.5 | LED2.K 25.28,17.83 24.77,18.34 24.77,25.5 26.87,27.6 | 26.87,27.6 26.96,27.5 36.27,27.5 38.74,25.03 38.74,20.13 | 130.43,82.5 129.93,82.5 v127.27,82.5 | v116.77,82.5 119.27,82.5
  Bottom 0.813: X6.2 3.87,93.93 | X8.2 | X9.2 | X4.2 | X11.2 56.98,93.63 | X12.2 | 76.28,93.66 X2.2 | 82.4,93.63 X13.2 86.17,93.54 X14.2 X15.2 114.01,93.55 X5.2 | X18.4 88.28,15.49 89.95,13.82 92.27,13.82 | 92.27,13.82 103.17,13.82 103.8,14.45 X16.4 | 38.74,17.47 X17.9 | 92.27,13.82 v92.27,20.5 | v100.77,29 101.79,30.02 X22.5 110.25,30.02 111.77,28.5 v114.27,28.5 | v124.51,28.5 124.51,36.24 128.08,39.81 132.25,39.81 U$1.OUT- | X1.2 130.93,88.36 129.93,87.36 129.93,82.5 | 130.43,82.5 130.43,81.84 132.84,79.43 U$1.IN- | U$2.JP2.7 122.67,67.91 124.27,69.5 124.27,93.5 | 13.89,17.18 12.45,17.18 12.27,17 v12.27,10.5 | v4.77,10.5 4.27,10.5 2.77,12 2.77,44.46 v26.77,44.46 | v40.77,73.5 40.77,78.03 B1.GND@0 B1.GND@1 | v40.77,61.5 70.27,61.5 72.77,64 72.77,70.5 75.54,73.27 B1.GND@2 B1.GND@3 117.04,73.27 119.27,75.5 119.27,82.5 119.27,93.5 119.26,93.51
  Bottom 1.27: X17.9 38.74,20.13 | U$4.2 13.89,17.18
  pour Bottom (isolate 0.635): -30.73,110.5 -30.73,-27.5 217.77,-27.5 217.77,110.5
  pour Top (isolate 0.406): -45.8,116.78 -45.8,-34.35 234.87,-34.35 234.87,116.78
LDR
  Bottom 0.61: 103.02,82.8 83.08,82.8
  Bottom 0.813: 104.48,89.6 104.48,84.26 103.02,82.8 | 83.08,82.8 81.73,81.45 81.73,79.5
  Bottom 1.27: B1.A11 81.73,79.5 | X15.3 104.48,89.6
N$1  (1 unrouted)
  Bottom 1.27: X2.3 76.05,90.89 75.23,90.89
N$2
  Bottom 0.61: JP2.1 73.4,88.56 75.1,88.56
  Bottom 1.27: X2.4 75.1,88.56
N$3  (via drill 3.5)
  other vias: 168.27,4
N$4  (via drill 3.5)
  other vias: 165.77,92
N$5  (1 unrouted)
  Bottom 0.813: 5.38,88.59 7.02,88.59 7.1,88.51
  Bottom 1.27: X6.4 5.38,88.59
N$6  (2 unrouted)
  Bottom 0.813: 6.98,91.13 7.1,91.01
  Bottom 1.27: X6.3 5.51,91.13
N$7
  Bottom 0.813: R1.2 28.31,23.83
  Bottom 1.27: R1.2 28.34,22.1 30.61,19.83 LED2.A
N$8  (1 unrouted)
  Bottom 0.813: 15.16,88.58 16.33,88.58 16.4,88.51
  Bottom 1.27: X7.4 15.16,88.58
N$9  (2 unrouted)
  Bottom 0.813: 16.39,91.12 16.4,91.11
  Bottom 1.27: X7.3 14.91,91.12
N$10  (2 unrouted)
  Bottom 0.61: 25.04,88.57 25.1,88.51
  Bottom 0.813: 23.8,88.57 25,88.57
  Bottom 1.27: X8.4 23.8,88.57
N$11  (1 unrouted)
  Bottom 1.27: X8.3 23.54,91.11
N$12  (1 unrouted)
  Bottom 0.813: 32.81,88.56 34.05,88.56 34.1,88.51
  Bottom 1.27: X9.4 32.81,88.56
N$13  (1 unrouted)
  Bottom 1.27: X9.3 30.98,91.13 32.43,91.13
N$14  (1 unrouted)
  Bottom 0.813: 41.7,88.55 42.68,88.55 42.7,88.53
  Bottom 1.27: X4.4 41.7,88.55
N$15  (2 unrouted)
  Bottom 0.813: 42.66,91.09 42.7,91.13
  Bottom 1.27: X4.3 41.19,91.09
N$16  (1 unrouted)
  Bottom 0.813: 49.96,88.55 51.38,88.55 51.4,88.53
  Bottom 1.27: X10.4 49.96,88.55
N$17  (2 unrouted)
  Bottom 0.813: 51.36,91.09 51.4,91.13
  Bottom 1.27: X10.3 50.08,91.09
N$18  (1 unrouted)
  Bottom 0.813: 58.59,88.59 60.04,88.59 60.1,88.53
  Bottom 1.27: X11.4 58.59,88.59
N$19  (1 unrouted)
  Bottom 1.27: X11.3 58.72,91.13
N$20  (1 unrouted)
  Bottom 0.813: 68.5,88.58 70.05,88.58 70.1,88.63
  Bottom 1.27: X12.4 68.5,88.58
N$21  (2 unrouted)
  Bottom 0.813: 69.89,91.12 69.9,91.13
  Bottom 1.27: X12.3 68.5,91.12
N$22  (via drill 3.5)
  other vias: 4.77,3.5
N$23  (via drill 3.5)
  other vias: 109.37,84.98
PB1
  Bottom 0.813: R8.1 112.97,41.6 111.55,40.18 X22.1 108,40.25 B1.29
PB2
  Bottom 0.813: R11.1 115.28,37.64 X22.2 108,37.71 B1.27
PB3
  Bottom 0.813: R9.1 112.17,34.1 111.17,35.1 X22.3 108,35.17 B1.25
PB4
  Bottom 0.813: R10.1 112.17,30.8 110.41,32.56 X22.4 108,32.63 B1.23
PHSENSOR
  Bottom 0.813: 86.08,89.6 86.08,87.43 84.77,86.12 77.39,86.12 76.65,85.38 76.65,80
  Bottom 1.27: B1.A9 76.65,80 | X13.3 86.08,89.6
RX1
  Bottom 0.61: 118.77,6 75.27,6
  Bottom 0.813: B1.19 81.73,26.82 80.91,26 75.27,26 74.27,27 74.27,32.5 72.27,34.5 24.27,34.5 21.77,32 21.77,13 23.52,11.25 70.02,11.25 75.27,6 | 107.27,52.67 118.1,52.67 119.77,51 119.77,7 118.77,6
  Bottom 1.27: U$2.JP2.1 107.27,52.67
SCL
  Bottom 0.61: 84.27,10.6 108.87,10.6 | 136.27,1.5 12.27,1.5
  Bottom 0.813: 83.14,17.85 83.14,22.23 83.64,22.73 R2.1 86.81,22.8 86.81,28.39 | 83.2,15.05 83.2,11.67 84.27,10.6 | 108.87,10.6 110.07,11.8 110.07,21.6 108.67,23 99.97,23 98.72,21.75 98.72,17.97 | 13.89,19.72 10.05,19.72 | 9.27,20.5 9.27,39.5 11.77,42 83.27,42 86.81,38.46 86.81,31.69 | 9.27,20.5 10.05,19.72 | 131.24,21.52 137.25,21.52 138.27,20.5 138.27,3.5 136.27,1.5 | U$3.J1.3 129.32,21.5 | 12.27,1.5 9.27,4.5 9.27,19 | 9.27,19 9.27,20.5 | 10.05,19.72 9.33,19 9.27,19
  Bottom 1.27: U$3.J1.3 131.24,21.52 | 83.14,17.85 83.14,16.46 X18.2 83.2,15.05 | X16.2 98.72,17.97 | U$4.3 13.89,19.72 | 86.81,31.69 B1.21 86.81,28.39
SDA
  Bottom 0.61: 82.82,9.05 112.02,9.05 | 69.52,3.04 124.3,3.04
  Bottom 0.813: 80.66,17.47 80.66,22.7 84.27,26.31 84.27,28.39 | 96.18,17.97 96.18,23.01 R3.1 96.12,24.07 96.77,24.72 111.55,24.72 113.57,22.7 113.57,10.6 112.02,9.05 | 80.66,14.67 80.66,11.21 82.82,9.05 | 84.27,31.56 84.27,36.5 81.27,39.5 14.27,39.5 11.96,37.19 11.96,23.31 13.01,22.26 14.27,22.26 | 16.56,22.26 17.01,22.26 17.77,21.5 17.77,7.5 19.52,5.75 66.8,5.75 69.52,3.04 | 127.68,18.98 126.25,18.98 125.27,18 125.27,4 124.3,3.04
  Bottom 1.27: U$3.J1.4 127.68,18.98 | 80.66,14.67 X18.1 80.66,17.47 | X16.1 96.18,17.97 | 14.27,22.26 U$4.4 16.56,22.26 | 84.27,31.56 B1.20 84.27,28.39
SOIL1
  Bottom 0.61: JP3.2 8.46,88.51 8.87,88.1
  Bottom 0.813: 8.87,88.5 8.87,90.9 8.76,91.01 JP4.2 | 8.87,88.5 8.87,88.1 8.87,66.9 10.27,65.5 55.27,65.5 56.27,66.5 56.27,76 | JP3.2 8.86,88.51 8.87,88.5
  Bottom 1.27: B1.A2 56.33,76.06 56.27,76
SOIL2
  Bottom 0.61: JP6.2 18.06,91.11 | JP5.2 18.06,88.51 18.07,88.5
  Bottom 0.813: 18.06,91.11 18.07,91.1 18.07,88.5 18.07,69.7 20.27,67.5 52.77,67.5 53.79,68.52 53.79,76
  Bottom 1.27: B1.A1 53.79,76
SOIL3
  Bottom 0.61: JP7.2 26.68,88.51 26.77,88.6 | JP8.2 26.76,91.11
  Bottom 0.813: 26.76,91.11 26.77,91.1 26.77,88.6 26.77,71.5 28.77,69.5 50.27,69.5 51.25,70.48 51.25,76
  Bottom 1.27: B1.A0 51.25,76
SOIL4
  Bottom 0.813: 58.87,79.5 58.87,80.4 58.05,81.22 38.71,81.22 35.77,84.16 35.77,88.5 | JP10.2 35.77,90.5 35.77,88.5 | JP9.2 35.76,88.51 35.77,88.5
  Bottom 1.27: B1.A3 58.87,79.5
SOIL5
  Bottom 0.813: 44.37,88.5 44.37,91.1 43.86,91.1 JP12.2 | 44.37,88.5 44.37,84.4 45.87,82.9 60.57,82.9 61.41,82.06 61.41,80 | JP11.2 43.86,88.5 44.37,88.5
  Bottom 1.27: B1.A4 61.41,80
SOIL6
  Bottom 0.813: 53.07,88.5 53.07,91.1 52.56,91.1 JP14.2 | 53.07,88.5 53.07,85.6 53.77,84.9 63.27,84.9 63.95,84.22 63.95,79.5 | JP13.2 52.56,88.5 53.07,88.5
  Bottom 1.27: B1.A5 63.95,79.5
SOIL7
  Bottom 0.813: 61.77,88 61.77,91.1 61.26,91.1 JP16.2 | 61.77,88 61.77,86.9 62.22,86.45 65.82,86.45 66.49,85.78 66.49,80 | JP15.2 61.76,88 61.77,88
  Bottom 1.27: B1.A6 66.49,80
SOIL8
  Bottom 0.813: 69.03,80 69.03,82.26 69.77,83 70.27,83 71.03,83.76 JP17.2 JP18.2
  Bottom 1.27: B1.A7 69.03,80
SSR1
  Bottom 0.813: 58.87,28.52 58.87,20.26
  Bottom 1.27: X17.1 58.87,18.56 58.87,20.26 | B1.2 58.87,28.52
SSR2
  Bottom 0.813: 56.52,28.52 56.52,20.13
  Bottom 1.27: X17.2 56.52,20.13 | B1.3 56.52,29.9 56.52,28.52
SSR3
  Bottom 0.813: 53.98,28.64 53.98,20.13
  Bottom 1.27: X17.3 53.98,20.13 | B1.4 53.98,29.9 53.98,28.64
SSR4
  Bottom 0.813: 51.44,28.77 51.44,20.13
  Bottom 1.27: X17.4 51.44,20.13 | B1.5 51.44,29.9 51.44,28.77
SSR5
  Bottom 0.813: 48.9,28.52 48.9,20.13
  Bottom 1.27: X17.5 48.9,20.13 | B1.6 48.9,29.9 48.9,28.52
SSR6
  Bottom 0.813: 46.17,28.52 46.17,20.39
  Bottom 1.27: X17.6 46.36,20.2 46.17,20.39 | B1.7 46.17,28.52
SSR7
  Bottom 0.813: 42.11,28.52 42.11,27.59 43.82,25.88 43.82,20.26
  Bottom 1.27: X17.7 43.82,20.26 | B1.8 42.11,28.52
SSR8
  Bottom 0.813: 39.57,28.64 39.57,26.89 41.28,25.18 41.28,20.13
  Bottom 1.27: X17.8 41.28,20.13 | B1.9 39.57,28.64
TX1
  Bottom 0.61: 121.77,4.5 72.27,4.5
  Bottom 0.813: 107.27,55.2 121.56,55.2 122.77,54 122.77,5.5 121.77,4.5 | 79.27,32.2 79.27,35 77.27,37 23.27,37 19.77,33.5 19.77,10 21.77,8 68.77,8 72.27,4.5
  Bottom 1.27: U$2.JP2.2 107.27,55.2 | B1.18 79.19,32.12 79.27,32.2
VCC  (via drill 0.8)
  Top 0.813: v126.69,16.45 126.67,16.47
  Top 1.27: v25.27,3.5 v25.27,14.5 | 126.67,16.47 v126.67,21.78 | v32.05,73.22 v5,73.22
  Bottom 0.813: X8.1 | X9.1 | X4.1 | X11.1 56.98,96.17 | X12.1 | 76.28,96.2 X2.1 | X15.1 104.48,96 | R10.2 117.22,30.9 | R8.2 117.22,41.75 | 85.62,16.52 X18.3 85.74,13.26 86.63,12.37 107.14,12.37 107.77,13 107.77,20 107.27,20.5 101.77,20.5 101.26,19.99 101.26,17.97 | 94.27,26.5 95.17,26.5 95.68,26.5 | 96.44,26.5 96.82,26.5 109.77,26.5 | 72.02,13.75 78.27,7.5 115.27,7.5 117.27,9.5 117.27,11.5 | 85.74,17.94 85.74,19.85 85.98,20.09 88.19,20.09 88.78,20.68 88.78,21.4 | U$3.J1.5 v126.7,16.44 v126.69,16.45 | X6.1 2.06,96.21 1.42,95.57 1.42,84.9 3.48,82.85
  Bottom 1.27: 104.48,96 100.28,96 X14.1 91.08,96.09 X13.1 X2.1 66.76,96.18 X12.1 | X15.1 113.98,96.09 X5.1 119.72,96.05 | 117.22,30.9 R9.2 R11.2 R8.2 117.22,45.25 115.97,46.5 104.77,46.5 103.27,48 103.27,69.5 104.21,70.44 U$2.JP2.8 120.21,70.44 121.77,72 121.77,94 | X12.1 X11.1 56.9,96.17 X10.1 X4.1 X9.1 | X6.1 X7.1 X8.1 | X8.1 X9.1 | R10.2 117.32,28.26 | 117.32,28.26 117.32,27.05 116.77,26.5 | 116.77,26.5 115.73,26.5 | 115.73,26.5 109.77,26.5 | 116.77,26.5 117.27,26.5 117.27,24.96 | 36.27,18.44 X17.10 | R1.1 30.27,23.83 | R1.1 30.24,23.95 | 119.72,96.05 121.77,94 | X17.10 36.2,15.57 | 117.27,11.5 117.27,24.96 | 36.2,15.57 37.27,14.5 | 37.27,14.5 71.27,14.5 72.02,13.75 | 119.72,96.05 121.77,96.05 | 121.77,96.05 123.77,96.05 | 123.77,96.05 168.22,96.05 169.77,94.5 169.77,41 168.27,39.5 158.97,39.5 U$1.OUT+ 152.31,39.81 147.88,35.37 128.19,35.37 126.67,33.85 v126.67,21.78 | 121.77,94 121.77,94.05 | 121.77,94.05 123.77,96.05 | 121.77,94.05 121.77,96.05 | v25.27,14.5 35.13,14.5 | 35.13,14.5 37.27,14.5 | U$4.1 15.35,5.42 17.27,3.5 v25.27,3.5 | X18.3 85.74,17.94 | 88.78,21.4 R2.2 88.78,25.55 89.73,26.5 93.65,26.5 | 93.65,26.5 94.27,26.5 | R3.2 94.22,25.93 | 94.22,25.93 94.22,26.45 94.27,26.5 | 93.65,26.5 94.22,25.93 | 94.22,25.93 94.79,26.5 95.17,26.5 | 117.27,24.96 115.73,26.5 | 115.73,26.5 115.73,26.67 117.32,28.26 | X16.3 101.26,17.97 | 36.2,15.57 35.13,14.5 | R1.1 34.99,23.8 36.2,22.59 X17.10 | 94.42,26.5 95.68,26.5 | 95.68,26.5 96.44,26.5 | B1.5V@1 95.68,30.09 | 95.68,30.09 B1.5V@2 | 95.68,30.09 95.68,27.75 | 95.68,26.5 95.68,27.75 | 95.68,27.75 94.42,26.5 | 94.42,26.5 94.27,26.5 | 95.68,27.75 96.82,26.61 96.82,26.5 | v126.69,16.45 U$3.J1.5
  Bottom 1.27: B1.5V@0 38.55,74.13 37.64,73.22 v32.05,73.22 | v5,73.22 3.73,73.22 3.48,73.47 3.48,82.85
(copper drawn outside any net)
  shapes: Top area x2

### Text on the board
Top: - | + | EC | LDR | S1 | S2 | S3 | S4 | S5 | S6 | S7 | S8 | CO | PH | DHT22 | Slave | Vreg | ContaGrow | Automated Container Hydroponic System | Relay | RTC | I2C | ContaGrow | Automated Container Hydroponic System
Bottom: - | + | Contagrow | Contagrow | Main Board